# Altium schematic sheet Memory.SchDoc
size Letter; Author: FF7 HD Remastered; SheetNumber: 2; SheetTotal: 7
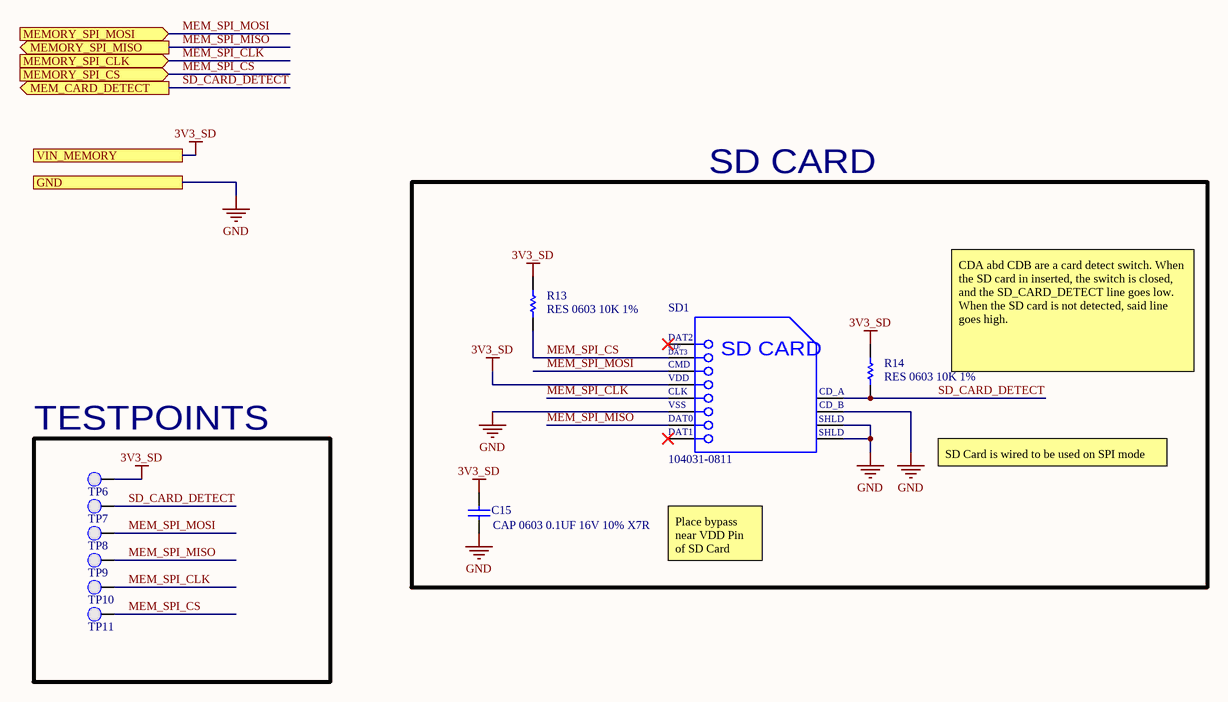
[diagram p0: Memory.SchDoc]

## Parts
C15  CAP 0603 0.1UF 16V 10% X7R  [0603_CAP]
R13  RES 0603 10K 1%  [0603_RES]
R14  RES 0603 10K 1%  [0603_RES]
SD1  104031-0811  [MOLX-104031-0811_V]
TP6  Test Point 0.1"  [Test Point 0.1"-Footprint-1]  (value not drawn)  (no BOM)
TP7  Test Point 0.1"  [Test Point 0.1"-Footprint-1]  (value not drawn)  (no BOM)
TP8  Test Point 0.1"  [Test Point 0.1"-Footprint-1]  (value not drawn)  (no BOM)
TP9  Test Point 0.1"  [Test Point 0.1"-Footprint-1]  (value not drawn)  (no BOM)
TP10  Test Point 0.1"  [Test Point 0.1"-Footprint-1]  (value not drawn)  (no BOM)
TP11  Test Point 0.1"  [Test Point 0.1"-Footprint-1]  (value not drawn)  (no BOM)

## Blocks framed on the sheet
SD CARD: C15 R13 R14 SD1
TESTPOINTS: TP6-TP11

## Ports
GND, MEM_CARD_DETECT (out), MEMORY_SPI_CLK (in), MEMORY_SPI_CS (in), MEMORY_SPI_MISO (out), MEMORY_SPI_MOSI (in), VIN_MEMORY

## Nets
3V3_SD: C15.2 R13.2 R14.2 SD1.4(VDD) TP6.1(PAD) ; port VIN_MEMORY
GND: C15.1 SD1.6(VSS2) SD1.10(CD_B) SD1.11(SHLD1) SD1.12(SHLD2) ; port GND
MEM_SPI_CLK: SD1.5(CLK) TP10.1(PAD) ; port MEMORY_SPI_CLK
MEM_SPI_CS: R13.1 SD1.2(CMD) TP11.1(PAD) ; port MEMORY_SPI_CS
MEM_SPI_MISO: SD1.7(DAT0) TP9.1(PAD) ; port MEMORY_SPI_MISO
MEM_SPI_MOSI: SD1.3(VSS1) TP8.1(PAD) ; port MEMORY_SPI_MOSI
SD_CARD_DETECT: R14.1 SD1.9(CD_A) TP7.1(PAD) ; port MEM_CARD_DETECT

Not connected (* = marked no-connect by the designer): SD1 1(CD/DAT3)* 8(DAT1)*

## Notes on the sheet
- CDA abd CDB are a card detect switch. When the SD card in inserted, the switch is closed, and the SD_CARD_DETECT line goes low. When the SD card is not detected, said line goes high.
- SD Card is wired to be used on SPI mode
- Place bypass near VDD Pin of SD Card
- Title:
- Desc:
- Size:
- Letter
- Auth:
- Proj:
- Sheet
- of
- www.seas.upenn.edu
- Electrical and Systems Engineering
- (in symbol CMP-2000-05825-1) DAT2; CD/; DAT3; SD CARD; VSS; SHLD

## Library data of the parts
C15 = CMP-011-000221-1: Capacitor Surface Mount 0603 Footprint 0.1UF 16V 10% Tolerance Ceramic X7R; Manufacturer: Various; Description in Visual: Cap SMT 0603 0.1UF 16V 10%  Cer X7R; PCB Package: 0603; Mount: SMT; Manufacturer P/N: CAP 0603 0.1UF 16V 10% X7R; Type: Ceramic X7R; Voltage: 16V; P/N: CAP 0603 0.1UF 16V 10% X7R; Value: 0.1UF; Tolerance: 10%
R13 R14 = CMP-005-002156-2: Resistor Surface Mount, 10K Ohms, 0603 Footprint, 1% Tolerance 0.1W; Manufacturer: Various; PCB Package: 0603; Description in Visual: Res SMT 10K 0603  1%  0.1W; Manufacturer P/N: RES 0603 10K 1%; Tolerance: 1%; Mount: SMT; Value: 10k; JLCPCB Part #: C25804; Power Rating: 0.1W
SD1 = CMP-2000-05825-1: Micro SD Card, RA, -25 to 85 degC, 8-Pin SMD, RoHS, Tape and Reel; Voltage Rating: 10VAC/DC; Number of Contacts: 8; Insertion - Extraction Style: Push-Pull; Pitch: 1.1mm; Mating Cycles: 10000; Brand: Molex; Current Rating: 500mA; Manufacturer URL: http://www.molex.com/; Card Type: microSD; Mounting Type: Standard; Height: 1.42mm; Mounting Technology: SurfaceMount; Contact Plating: Gold; Product Category: MemoryCardConnectors; Package Description: 8-Pin Surface Mount Device, Body 11.95 x 11.4 mm, Pitch 1.1 mm; Datasheet URL: http://www.molex.com/pdm_docs/sd/1040310811_sd.pdf; Termination Style: SMD; Length: 11.4mm; Housing Material: LiquidCrystalPolymer(LCP); Orientation: RightAngle; RoHS: True; Contact Material: PhosphorBronze; Datasheet Version: Rev. E, 04/2006; Packaging: Reel; Manufacturer: Molex; Series: 104031; Product: CardConnectors; Number of Rows: 1Row; Package Reference: 104031-0811
TP6-TP11 = CMP-00086-1